# EAGLE schematic buck_converter (EAGLE 9.6.2)
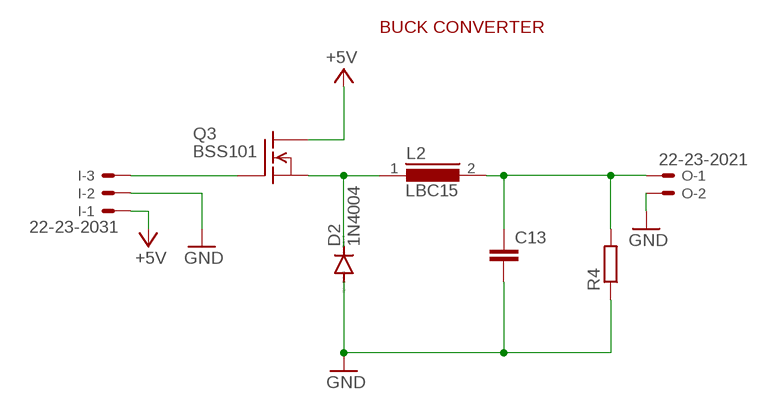
[diagram p0: schematic, sheet 1]

## Parts
C13  C2.5/2  [C2.5-2]
D2  1N4004  [DO41-10]
I  22-23-2031  [22-23-2031]
L2  LBC15  [LBC15]
O  22-23-2021  [22-23-2021]
Q3  BSS101  [TO92]
R4  R-EU_0207/10  [0207/10]

## Nets
+5V: I.1 Q3.3(D)
BCO: C13.1 L2.2 O.1 R4.2
GND: C13.2 D2.A I.2 O.2 R4.1
N$1: I.3 Q3.2(G)
N$5: D2.C L2.1 Q3.1(S)

## Notes on the sheet
- BUCK CONVERTER

## Library data of the parts
C13 = capacitor-wima:C: CAPACITOR naming: grid - package width
D2 = diode:1N4004: DIODE general purpose rectifier, 1 A
I = con-molex:22-23-2031: .100" (2.54mm) Center Header - 3 Pin; MF: MOLEX; MPN: 22-23-2031; OC_FARNELL: 1462950; OC_NEWARK: 30C0862
L2 = inductors:LBC15: INDUCTOR; SPICEPREFIX: L
O = con-molex:22-23-2021: .100" (2.54mm) Center Header - 2 Pin; MF: MOLEX; MPN: 22-23-2021; OC_FARNELL: 1462926; OC_NEWARK: 25C3832
Q3 = transistor-fet:BSS101: N-Channel Enhancement MOSFET 200V; 0,16A; 11Ohm
R4 = rcl:R-EU_: RESISTOR, European symbol; SPICEPREFIX: R

## Net classes
0 default: width 0.305 mm, drill 0.508 mm, clearance 0.254 mm